# Altium project Pleiades_P01.PrjPcb (part 9 of 10)

## Sheet PCI.SchDoc
size 558 x 431 mm; SheetNumber: 18; SheetTotal: 25; Sheet_Name: PCI; Size: 11x17
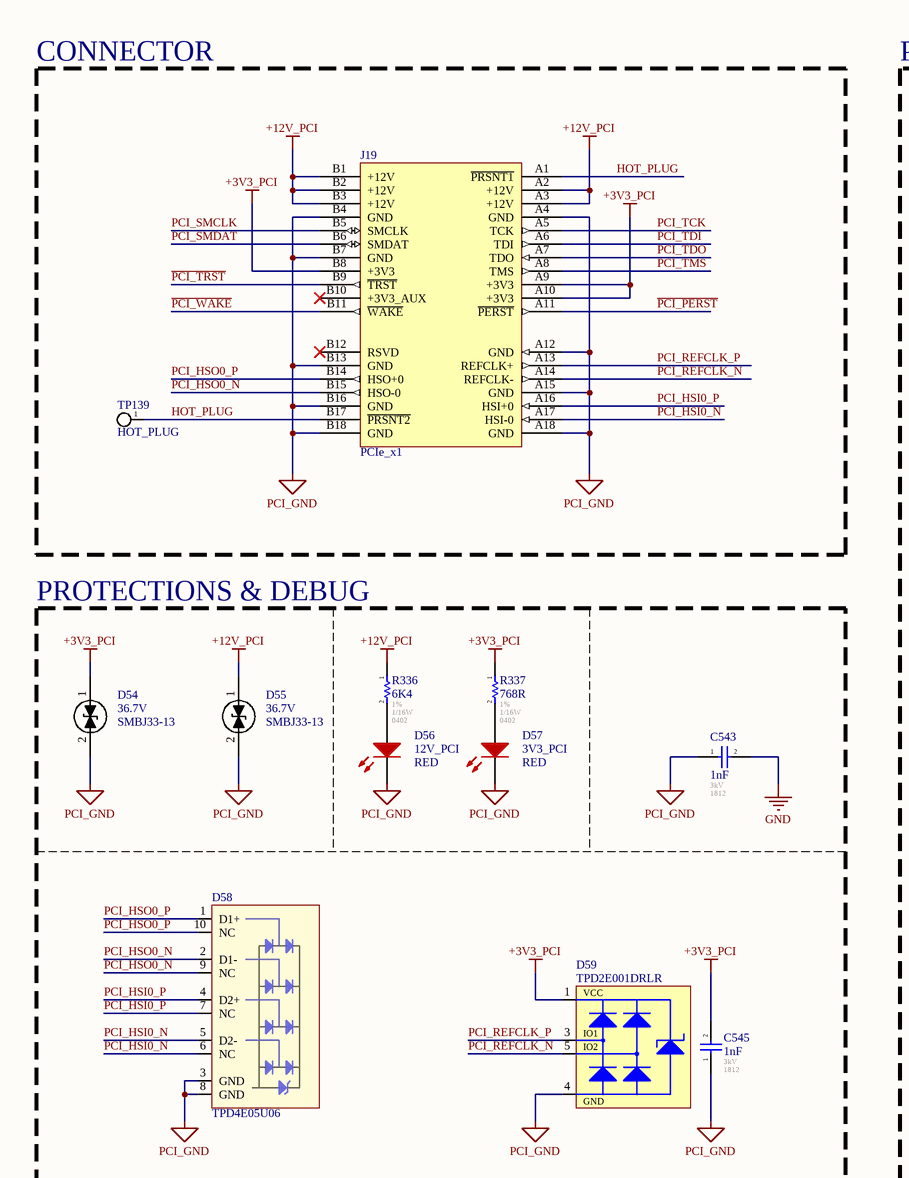
[diagram p59: PCI.SchDoc, top left]
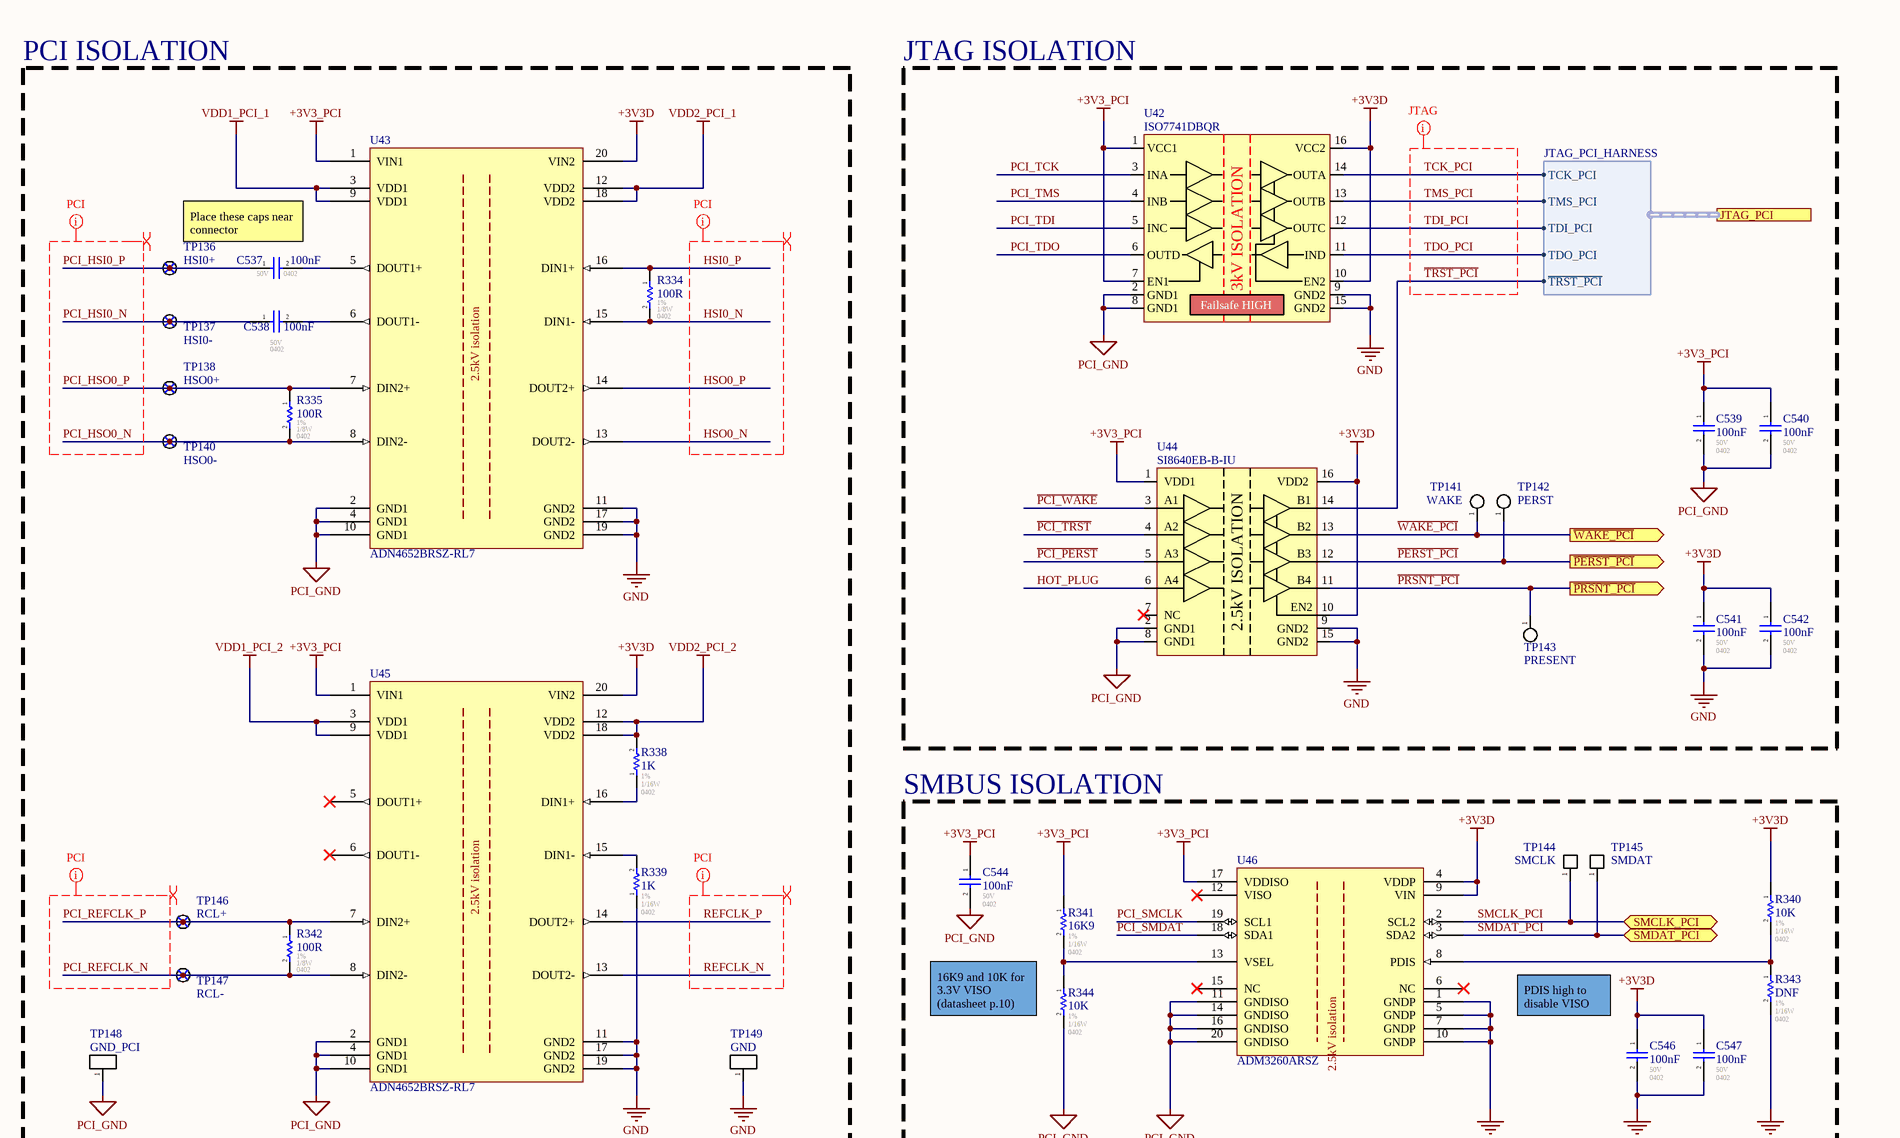
[diagram p60: PCI.SchDoc, top right]
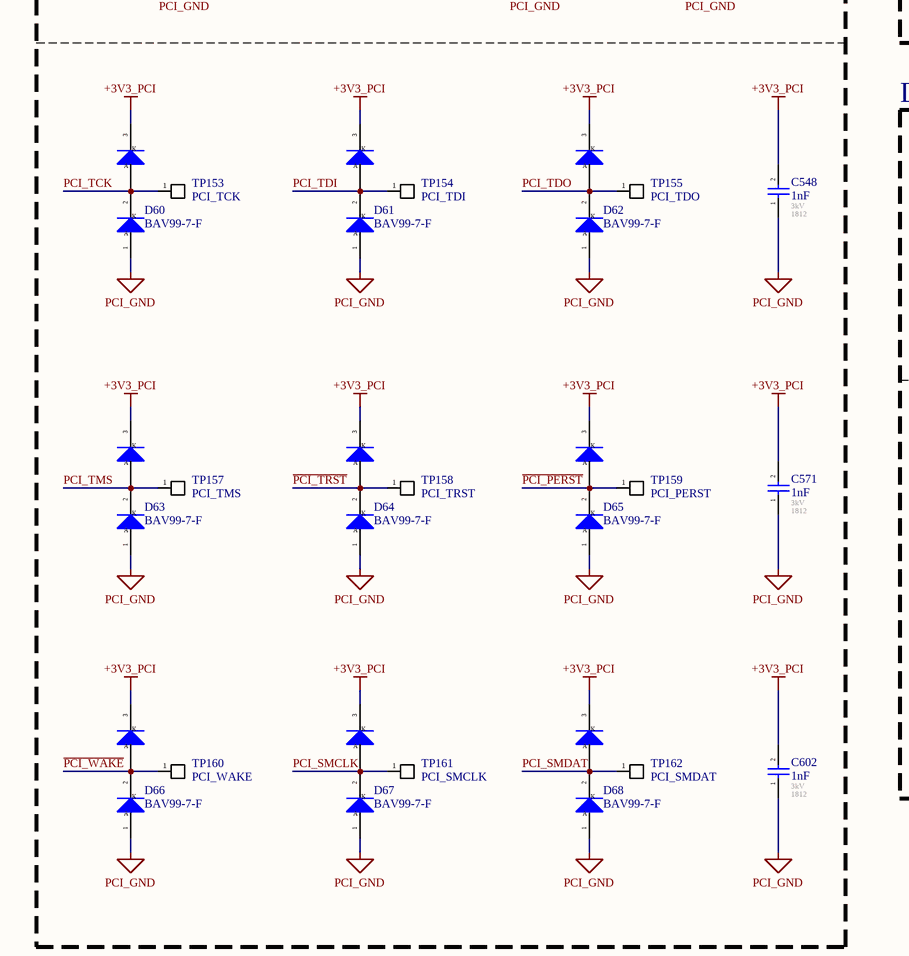
[diagram p61: PCI.SchDoc, bottom left]
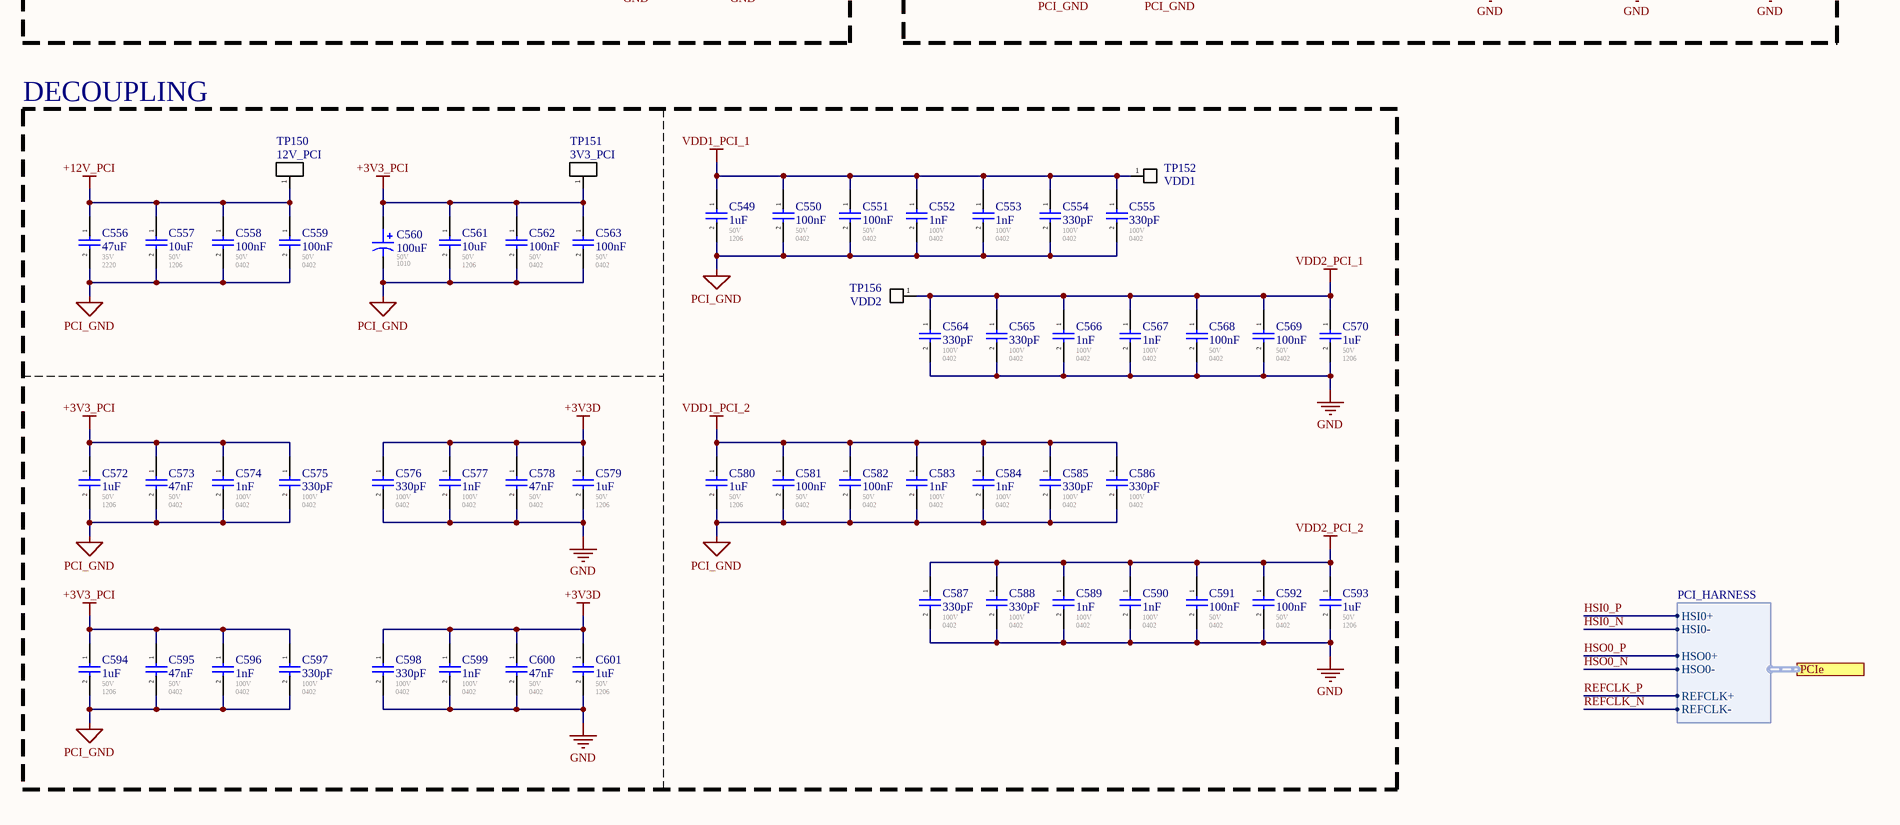
[diagram p62: PCI.SchDoc, bottom right]

### Parts
C537  100nF  Voltage - Rated: 50V  Footprint: 0402  [CAP_0402]
C538  100nF  Voltage - Rated: 50V  Footprint: 0402  [CAP_0402]
C539  100nF  Voltage - Rated: 50V  Footprint: 0402  [CAP_0402]
C540  100nF  Voltage - Rated: 50V  Footprint: 0402  [CAP_0402]
C541  100nF  Voltage - Rated: 50V  Footprint: 0402  [CAP_0402]
C542  100nF  Voltage - Rated: 50V  Footprint: 0402  [CAP_0402]
C543  1nF  Voltage - Rated: 3kV  Footprint: 1812  [CAP_1812]
C544  100nF  Voltage - Rated: 50V  Footprint: 0402  [CAP_0402]
C545  1nF  Voltage - Rated: 3kV  Footprint: 1812  [CAP_1812]
C546  100nF  Voltage - Rated: 50V  Footprint: 0402  [CAP_0402]
C547  100nF  Voltage - Rated: 50V  Footprint: 0402  [CAP_0402]
C548  1nF  Voltage - Rated: 3kV  Footprint: 1812  [CAP_1812]
C549  1uF  Voltage - Rated: 50V  Footprint: 1206  [CAP_1206]
C550  100nF  Voltage - Rated: 50V  Footprint: 0402  [CAP_0402]
C551  100nF  Voltage - Rated: 50V  Footprint: 0402  [CAP_0402]
C552  1nF  Voltage - Rated: 100V  Footprint: 0402  [CAP_0402]
C553  1nF  Voltage - Rated: 100V  Footprint: 0402  [CAP_0402]
C554  330pF  Voltage - Rated: 100V  Footprint: 0402  [CAP_0402]
C555  330pF  Voltage - Rated: 100V  Footprint: 0402  [CAP_0402]
C556  47uF  Voltage - Rated: 35V  Footprint: 2220  [CAP_2220]
C557  10uF  Voltage - Rated: 50V  Footprint: 1206  [CAP_1206]
C558  100nF  Voltage - Rated: 50V  Footprint: 0402  [CAP_0402]
C559  100nF  Voltage - Rated: 50V  Footprint: 0402  [CAP_0402]
C560  value 100uF  Voltage: 50V  Package: 1010  [CAP_ALU_1010_vishay]  (hidden comment: MAL215099101E3)
C561  10uF  Voltage - Rated: 50V  Footprint: 1206  [CAP_1206]
C562  100nF  Voltage - Rated: 50V  Footprint: 0402  [CAP_0402]
C563  100nF  Voltage - Rated: 50V  Footprint: 0402  [CAP_0402]
C564  330pF  Voltage - Rated: 100V  Footprint: 0402  [CAP_0402]
C565  330pF  Voltage - Rated: 100V  Footprint: 0402  [CAP_0402]
C566  1nF  Voltage - Rated: 100V  Footprint: 0402  [CAP_0402]
C567  1nF  Voltage - Rated: 100V  Footprint: 0402  [CAP_0402]
C568  100nF  Voltage - Rated: 50V  Footprint: 0402  [CAP_0402]
C569  100nF  Voltage - Rated: 50V  Footprint: 0402  [CAP_0402]
C570  1uF  Voltage - Rated: 50V  Footprint: 1206  [CAP_1206]
C571  1nF  Voltage - Rated: 3kV  Footprint: 1812  [CAP_1812]
C572  1uF  Voltage - Rated: 50V  Footprint: 1206  [CAP_1206]
C573  47nF  Voltage - Rated: 50V  Footprint: 0402  [CAP_0402]
C574  1nF  Voltage - Rated: 100V  Footprint: 0402  [CAP_0402]
C575  330pF  Voltage - Rated: 100V  Footprint: 0402  [CAP_0402]
C576  330pF  Voltage - Rated: 100V  Footprint: 0402  [CAP_0402]
C577  1nF  Voltage - Rated: 100V  Footprint: 0402  [CAP_0402]
C578  47nF  Voltage - Rated: 50V  Footprint: 0402  [CAP_0402]
C579  1uF  Voltage - Rated: 50V  Footprint: 1206  [CAP_1206]
C580  1uF  Voltage - Rated: 50V  Footprint: 1206  [CAP_1206]
C581  100nF  Voltage - Rated: 50V  Footprint: 0402  [CAP_0402]
C582  100nF  Voltage - Rated: 50V  Footprint: 0402  [CAP_0402]
C583  1nF  Voltage - Rated: 100V  Footprint: 0402  [CAP_0402]
C584  1nF  Voltage - Rated: 100V  Footprint: 0402  [CAP_0402]
C585  330pF  Voltage - Rated: 100V  Footprint: 0402  [CAP_0402]
C586  330pF  Voltage - Rated: 100V  Footprint: 0402  [CAP_0402]
C587  330pF  Voltage - Rated: 100V  Footprint: 0402  [CAP_0402]
C588  330pF  Voltage - Rated: 100V  Footprint: 0402  [CAP_0402]
C589  1nF  Voltage - Rated: 100V  Footprint: 0402  [CAP_0402]
C590  1nF  Voltage - Rated: 100V  Footprint: 0402  [CAP_0402]
C591  100nF  Voltage - Rated: 50V  Footprint: 0402  [CAP_0402]
C592  100nF  Voltage - Rated: 50V  Footprint: 0402  [CAP_0402]
C593  1uF  Voltage - Rated: 50V  Footprint: 1206  [CAP_1206]
C594  1uF  Voltage - Rated: 50V  Footprint: 1206  [CAP_1206]
C595  47nF  Voltage - Rated: 50V  Footprint: 0402  [CAP_0402]
C596  1nF  Voltage - Rated: 100V  Footprint: 0402  [CAP_0402]
C597  330pF  Voltage - Rated: 100V  Footprint: 0402  [CAP_0402]
C598  330pF  Voltage - Rated: 100V  Footprint: 0402  [CAP_0402]
C599  1nF  Voltage - Rated: 100V  Footprint: 0402  [CAP_0402]
C600  47nF  Voltage - Rated: 50V  Footprint: 0402  [CAP_0402]
C601  1uF  Voltage - Rated: 50V  Footprint: 1206  [CAP_1206]
C602  1nF  Voltage - Rated: 3kV  Footprint: 1812  [CAP_1812]
D54  SMBJ33-13  Voltage - Breakdown: 36.7V  [DO214AA (SMB)]
D55  SMBJ33-13  Voltage - Breakdown: 36.7V  [DO214AA (SMB)]
D56  12V_PCI  value RED  [LED_0603]
D57  3V3_PCI  value RED  [LED_0603]
D58  TPD4E05U06  [TVS_DATA_TPD4E05U06]
D59  TPD2E001DRLR  [TVS_USB_TPD2E001DRLR]
D60  BAV99-7-F  [SOT23-3]
D61  BAV99-7-F  [SOT23-3]
D62  BAV99-7-F  [SOT23-3]
D63  BAV99-7-F  [SOT23-3]
D64  BAV99-7-F  [SOT23-3]
D65  BAV99-7-F  [SOT23-3]
D66  BAV99-7-F  [SOT23-3]
D67  BAV99-7-F  [SOT23-3]
D68  BAV99-7-F  [SOT23-3]
J19  PCIe_x1  [PCIe_x1]  (no BOM)
R334  100R  Tolerance: 1%  Power: 1/8W  Package / Case: 0402  [RES_0402]
R335  100R  Tolerance: 1%  Power: 1/8W  Package / Case: 0402  [RES_0402]
R336  6K4  Tolerance: 1%  Power: 1/16W  Package / Case: 0402  [RES_0402]
R337  768R  Tolerance: 1%  Power: 1/16W  Package / Case: 0402  [RES_0402]
R338  1K  Tolerance: 1%  Power: 1/16W  Package / Case: 0402  [RES_0402]
R339  1K  Tolerance: 1%  Power: 1/16W  Package / Case: 0402  [RES_0402]
R340  10K  Tolerance: 1%  Power: 1/16W  Package / Case: 0402  [RES_0402]
R341  16K9  Tolerance: 1%  Power: 1/16W  Package / Case: 0402  [RES_0402]
R342  100R  Tolerance: 1%  Power: 1/8W  Package / Case: 0402  [RES_0402]
R343  DNF  Tolerance: 1%  Power: 1/16W  Package / Case: 0402  [RES_0402]
R344  10K  Tolerance: 1%  Power: 1/16W  Package / Case: 0402  [RES_0402]
TP136  HSI0+  [TP_PAD_TINY]  (no BOM)
TP137  HSI0-  [TP_PAD_TINY]  (no BOM)
TP138  HSO0+  [TP_PAD_TINY]  (no BOM)
TP139  HOT_PLUG  [TP_PAD_SMALL]  (no BOM)
TP140  HSO0-  [TP_PAD_TINY]  (no BOM)
TP141  WAKE  [TP_PAD_SMALL]  (no BOM)
TP142  PERST  [TP_PAD_SMALL]  (no BOM)
TP143  PRESENT  [TP_PAD_SMALL]  (no BOM)
TP144  SMCLK  [TP_PAD]  (no BOM)
TP145  SMDAT  [TP_PAD]  (no BOM)
TP146  RCL+  [TP_PAD_TINY]  (no BOM)
TP147  RCL-  [TP_PAD_TINY]  (no BOM)
TP148  GND_PCI  [TP_HOLE]  (no BOM)
TP149  GND  [TP_HOLE]  (no BOM)
TP150  12V_PCI  [TP_HOLE]  (no BOM)
TP151  3V3_PCI  [TP_HOLE]  (no BOM)
TP152  VDD1  [TP_PAD]  (no BOM)
TP153  PCI_TCK  [TP_PAD]  (no BOM)
TP154  PCI_TDI  [TP_PAD]  (no BOM)
TP155  PCI_TDO  [TP_PAD]  (no BOM)
TP156  VDD2  [TP_PAD]  (no BOM)
TP157  PCI_TMS  [TP_PAD]  (no BOM)
TP158  PCI_TRST  [TP_PAD]  (no BOM)
TP159  PCI_PERST  [TP_PAD]  (no BOM)
TP160  PCI_WAKE  [TP_PAD]  (no BOM)
TP161  PCI_SMCLK  [TP_PAD]  (no BOM)
TP162  PCI_SMDAT  [TP_PAD]  (no BOM)
U42  ISO7741DBQR  [ISO_ISO7741DBQR]
U43  ADN4652BRSZ-RL7  [TSSOP-20_5.3MM]
U44  SI8640EB-B-IU  [ISO_SI8640EB-B-IU]
U45  ADN4652BRSZ-RL7  [TSSOP-20_5.3MM]
U46  ADM3260ARSZ  [TSSOP-20_5.3MM]

### Blocks framed on the sheet
CONNECTOR: J19 TP139
PCI ISOLATION: C537 C538 R334 R335 R338 R339 R342 TP136-TP138 TP140 TP146-TP149 U43 U45
JTAG ISOLATION: C539-C542 TP141-TP143 U42 U44
PROTECTIONS & DEBUG: C543 C545 C548 C571 C602 D54-D68 R336 R337 TP153-TP155 TP157-TP162
SMBUS ISOLATION: C544 C546 C547 R340 R341 R343 R344 TP144 TP145 U46
DECOUPLING: C549-C570 C572-C601 TP150-TP152 TP156

### Ports
JTAG_PCI (harness JTAG_PCI_HARNESS), PCIe (harness PCI_HARNESS), SMCLK_PCI (bidir), SMDAT_PCI (bidir), ~{PERST_PCI} (out), ~{PRSNT_PCI} (out), ~{WAKE_PCI} (out)

### Harnesses
JTAG_PCI_HARNESS: TCK_PCI, TDO_PCI, TDI_PCI, TMS_PCI, ~{TRST_PCI}
PCI_HARNESS: HSI0+, HSI0-, HSO0+, HSO0-, REFCLK+, REFCLK-

### Nets
+3V3_PCI: C539.1 C540.1 C544.1 C545.2 C548.2 C560.1 C561.1 C562.1 C563.1 C571.2 C572.1 C573.1 C574.1 C575.1 C594.1 C595.1 C596.1 C597.1 C602.2 D54.1(A) D59.1(VCC) D60.3(K) D61.3(K) D62.3(K) D63.3(K) D64.3(K) D65.3(K) D66.3(K) D67.3(K) D68.3(K) J19.A9(+3V3) J19.A10(+3V3) J19.B8(+3V3) R337.1 R341.1 TP151.1(A) U42.1(VCC1) U42.7(EN1) U43.1(VIN1) U44.1(VDD1) U45.1(VIN1) U46.17(VDDISO)
+3V3D: C541.1 C542.1 C546.1 C547.1 C576.1 C577.1 C578.1 C579.1 C598.1 C599.1 C600.1 C601.1 R340.1 U42.10(EN2) U42.16(VCC2) U43.20(VIN2) U44.10(EN2) U44.16(VDD2) U45.20(VIN2) U46.4(VDDP) U46.9(VIN)
+12V_PCI: C556.1 C557.1 C558.1 C559.1 D55.1(A) J19.A2(+12V) J19.A3(+12V) J19.B1(+12V) J19.B2(+12V) J19.B3(+12V) R336.1 TP150.1(A)
GND: C541.2 C542.2 C543.2 C546.2 C547.2 C564.2 C565.2 C566.2 C567.2 C568.2 C569.2 C570.2 C576.2 C577.2 C578.2 C579.2 C587.2 C588.2 C589.2 C590.2 C591.2 C592.2 C593.2 C598.2 C599.2 C600.2 C601.2 R339.1 R343.2 TP149.1(A) U42.9(GND2) U42.15(GND2) U43.11(GND2) U43.17(GND2) U43.19(GND2) U44.9(GND2) U44.15(GND2) U45.11(GND2) U45.17(GND2) U45.19(GND2) U46.1(GNDP) U46.5(GNDP) U46.7(GNDP) U46.10(GNDP)
PCI_GND: C539.2 C540.2 C543.1 C544.2 C545.1 C548.1 C549.2 C550.2 C551.2 C552.2 C553.2 C554.2 C555.2 C556.2 C557.2 C558.2 C559.2 C560.2 C561.2 C562.2 C563.2 C571.1 C572.2 C573.2 C574.2 C575.2 C580.2 C581.2 C582.2 C583.2 C584.2 C585.2 C586.2 C594.2 C595.2 C596.2 C597.2 C602.1 D54.2(C) D55.2(C) D56.2(K) D57.2(K) D58.3(GND) D58.8(GND) D59.4(GND) D60.1(A) D61.1(A) D62.1(A) D63.1(A) D64.1(A) D65.1(A) D66.1(A) D67.1(A) D68.1(A) J19.A4(GND) J19.A12(GND) J19.A15(GND) J19.A18(GND) J19.B4(GND) J19.B7(GND) J19.B13(GND) J19.B16(GND) J19.B18(GND) R344.2 TP148.1(A) U42.2(GND1) U42.8(GND1) U43.2(GND1) U43.4(GND1) U43.10(GND1) U44.2(GND1) U44.8(GND1) U45.2(GND1) U45.4(GND1) U45.10(GND1) U46.11(GNDISO) U46.14(GNDISO) U46.16(GNDISO) U46.20(GNDISO)
VDD1_PCI_1: C549.1 C550.1 C551.1 C552.1 C553.1 C554.1 C555.1 TP152.1(A) U43.3(VDD1) U43.9(VDD1)
VDD1_PCI_2: C580.1 C581.1 C582.1 C583.1 C584.1 C585.1 C586.1 U45.3(VDD1) U45.9(VDD1)
VDD2_PCI_1: C564.1 C565.1 C566.1 C567.1 C568.1 C569.1 C570.1 TP156.1(A) U43.12(VDD2) U43.18(VDD2)
VDD2_PCI_2: C587.1 C588.1 C589.1 C590.1 C591.1 C592.1 C593.1 R338.2 U45.12(VDD2) U45.18(VDD2)
~{PCI_PERST}: D65.2(K) J19.A11(~{PERST}) TP159.1(A) U44.5(A3)  [project net ~{PCI_PERST_18}]
~{PCI_TRST}: D64.2(K) J19.B9(~{TRST}) TP158.1(A) U44.4(A2)  [project net ~{PCI_TRST_18}]
~{PCI_WAKE}: D66.2(K) J19.B11(~{WAKE}) TP160.1(A) U44.3(A1)  [project net ~{PCI_WAKE_18}]
~{PERST_PCI}: TP142.1(A) U44.12(B3) ; port ~{PERST_PCI}
~{PRSNT_PCI}: TP143.1(A) U44.11(B4) ; port ~{PRSNT_PCI}
~{TRST_PCI}: U44.14(B1) ; port JTAG_PCI.~{TRST_PCI}  [project net ~{PCI_TRST}]
~{WAKE_PCI}: TP141.1(A) U44.13(B2) ; port ~{WAKE_PCI}
HOT_PLUG: J19.A1(~{PRSNT1}) J19.B17(~{PRSNT2}) TP139.1(A) U44.6(A4)  [project net HOT_PLUG_18]
HSI0_N: R334.2 U43.15(DIN1-) ; port PCIe.HSI0-
HSI0_P: R334.1 U43.16(DIN1+) ; port PCIe.HSI0+
HSO0_N: U43.13(DOUT2-) ; port PCIe.HSO0-
HSO0_P: U43.14(DOUT2+) ; port PCIe.HSO0+
PCI_HSI0_N: C538.1 D58.5(D2-) D58.6(NC) J19.A17(HSI-0) TP137.1(A)  [project net PCI_HSI0_N_18]
PCI_HSI0_P: C537.1 D58.4(D2+) D58.7(NC) J19.A16(HSI+0) TP136.1(A)  [project net PCI_HSI0_P_18]
PCI_HSO0_N: D58.2(D1-) D58.9(NC) J19.B15(HSO-0) R335.2 TP140.1(A) U43.8(DIN2-)  [project net PCI_HSO0_N_18]
PCI_HSO0_P: D58.1(D1+) D58.10(NC) J19.B14(HSO+0) R335.1 TP138.1(A) U43.7(DIN2+)  [project net PCI_HSO0_P_18]
PCI_REFCLK_N: D59.5(IO2) J19.A14(REFCLK-) R342.2 TP147.1(A) U45.8(DIN2-)  [project net PCI_REFCLK_N_18]
PCI_REFCLK_P: D59.3(IO1) J19.A13(REFCLK+) R342.1 TP146.1(A) U45.7(DIN2+)  [project net PCI_REFCLK_P_18]
PCI_SMCLK: D67.2(K) J19.B5(SMCLK) TP161.1(A) U46.19(SCL1)  [project net PCI_SMCLK_18]
PCI_SMDAT: D68.2(K) J19.B6(SMDAT) TP162.1(A) U46.18(SDA1)  [project net PCI_SMDAT_18]
PCI_TCK: D60.2(K) J19.A5(TCK) TP153.1(A) U42.3(INA)  [project net PCI_TCK_18]
PCI_TDI: D61.2(K) J19.A6(TDI) TP154.1(A) U42.5(INC)  [project net PCI_TDI_18]
PCI_TDO: D62.2(K) J19.A7(TDO) TP155.1(A) U42.6(OUTD)  [project net PCI_TDO_18]
PCI_TMS: D63.2(K) J19.A8(TMS) TP157.1(A) U42.4(INB)  [project net PCI_TMS_18]
REFCLK_N: U45.13(DOUT2-) ; port PCIe.REFCLK-
REFCLK_P: U45.14(DOUT2+) ; port PCIe.REFCLK+
SMCLK_PCI: TP144.1(A) U46.2(SCL2) ; port SMCLK_PCI
SMDAT_PCI: TP145.1(A) U46.3(SDA2) ; port SMDAT_PCI
TCK_PCI: U42.14(OUTA) ; port JTAG_PCI.TCK_PCI  [project net PCI_TCK]
TDI_PCI: U42.12(OUTC) ; port JTAG_PCI.TDI_PCI  [project net PCI_TDI]
TDO_PCI: U42.11(IND) ; port JTAG_PCI.TDO_PCI  [project net PCI_TDO]
TMS_PCI: U42.13(OUTB) ; port JTAG_PCI.TMS_PCI  [project net PCI_TMS]
NetC537_2: C537.2 U43.5(DOUT1+)
NetC538_2: C538.2 U43.6(DOUT1-)
NetD56_1: D56.1(A) R336.2
NetD57_1: D57.1(A) R337.2
NetR338_1: R338.1 U45.16(DIN1+)
NetR339_2: R339.2 U45.15(DIN1-)
NetR340_2: R340.2 R343.1 U46.8(PDIS)
NetR341_2: R341.2 R344.1 U46.13(VSEL)

Not connected (* = marked no-connect by the designer): D59 2(NC); J19 B10(+3V3_AUX)* B12(RSVD)*; U44 7(NC)*; U45 5(DOUT1+)* 6(DOUT1-)*; U46 6(NC)* 12(VISO)* 15(NC)*

### Layout directives
net class JTAG: TCK_PCI, TDI_PCI, TDO_PCI, TMS_PCI, ~{TRST_PCI}
net class PCI: HSI0_N, HSI0_P, HSO0_N, HSO0_P, PCI_HSI0_N, PCI_HSI0_P, PCI_HSO0_N, PCI_HSO0_P, PCI_REFCLK_N, PCI_REFCLK_P, REFCLK_N, REFCLK_P
differential pair: HSI0_N, HSI0_P, HSO0_N, HSO0_P, PCI_HSI0_N, PCI_HSI0_P, PCI_HSO0_N, PCI_HSO0_P, PCI_REFCLK_N, PCI_REFCLK_P, REFCLK_N, REFCLK_P

### Notes on the sheet
- Place these caps near connector
- 16K9 and 10K for 3.3V VISO
  (datasheet p.10)
- (near C546) PDIS high to disable VISO
- Sheet Name
- Project Title
- Global Project
- Revision
- Size
- Date
- Group
- Sheet
- of
- Filename
- Designers
- (in symbol ADM3260ARSZ) 2.5kV isolation
- (in symbol ADN4652BRSZ-RL7) 2.5kV isolation
- (in symbol ISO_ISO7741DBQR) 3kV ISOLATION; Failsafe HIGH
- (in symbol ISO_SI8640EB-B-IU) 2.5kV ISOLATION

### Library data of the parts
C537-C542 C544 C546 C547 C550 C551 C558 C559 C562 C563 C568 C569 C581 C582 C591 C592 = CAP_CER: GCM155R71H104KE02J / 0402 100nF 10% X7R Ceramic Capacitor; Mfr: Murata; Operating Temperature: -55C - 125C; Temperature Coefficient: X7R; ComponentLink1Description: Digikey; ComponentLink1URL: [Digikey Link]; Part#: GCM155R71H104KE02J; ComponentLink2Description: Datasheet; ComponentLink2URL: [Datasheet Link]; Tolerance: 10%; Ratings: AEC-Q200
C543 C545 C548 C571 C602 = CAP_CER: C1812C102KHRACAUTO / 0402 470pF 10% X7R Ceramic Capacitor; Mfr: KEMET; Operating Temperature: -55C - 125C; Temperature Coefficient: X7R; ComponentLink1Description: Digikey; ComponentLink1URL: https://www.digikey.com/en/products/detail/kemet/C1812C102KHRACAUTO/8109956; Part#: C1812C102KHRACAUTO; ComponentLink2Description: Datasheet; ComponentLink2URL: https://connect.kemet.com:7667/gateway/IntelliData-ComponentDocumentation/1.0/download/datasheet/C1812C102KHRACAUTO; Tolerance: 10%; Ratings: AEC-Q200; ComponentLink3Description: KEMET; ComponentLink3URL: https://www.kemet.com/en/us/capacitors/ceramic/product/C1812C102KHRACAUTO.html; ComponentLink4Description: Octopart; ComponentLink4URL: https://octopart.com/c1812c102khracauto-kemet-67309371?r=sp; Features: Low ESL, High Voltage; Supplier 1: Mouser; Supplier Part Number 1: 80-C1812C102KHRAUTO
C549 C570 C572 C579 C580 C593 C594 C601 = CAP_CER: GCJ31CR71H105KA12L / 1206 1uF 10% X7R Ceramic Capacitor; Mfr: Murata; Operating Temperature: -55C - 125C; Temperature Coefficient: X7R; ComponentLink1Description: Digikey; ComponentLink1URL: [Digikey Link]; Part#: GCJ31CR71H105KA12L; ComponentLink2Description: Datasheet; ComponentLink2URL: [Datasheet Link]; Tolerance: 10%; Ratings: AEC-Q200
C552 C553 C566 C567 C574 C577 C583 C584 C589 C590 C596 C599 = CAP_CER: GCM155R72A102KA37D / 0402 1nF 10% X7R Ceramic Capacitor; Mfr: Murata; Operating Temperature: -55C - 125C; Temperature Coefficient: X7R; ComponentLink1Description: Digikey; ComponentLink1URL: [Digikey Link]; Part#: GCM155R72A102KA37D; ComponentLink2Description: Datasheet; ComponentLink2URL: [Datasheet Link]; Tolerance: 10%; Ratings: AEC-Q200
C554 C555 C564 C565 C575 C576 C585-C588 C597 C598 = CAP_CER: GCM155R72A331KA37D / 0402 330pF 10% X7R Ceramic Capacitor; Mfr: Murata; Operating Temperature: -55C - 125C; Temperature Coefficient: X7R; ComponentLink1Description: Digikey; ComponentLink1URL: https://www.digikey.ca/en/products/detail/murata-electronics/GCM155R72A331KA37D/2591348; Part#: GCM155R72A331KA37D; ComponentLink2Description: Datasheet; ComponentLink2URL: https://search.murata.co.jp/Ceramy/image/img/A01X/G101/ENG/GCM155R72A331KA37-01A.pdf; Tolerance: 10%; Ratings: AEC-Q200; ComponentLink3Description: Murata; ComponentLink3URL: https://www.murata.com/en-us/products/productdetail?partno=GCM155R72A331KA37%23; ComponentLink4Description: Octopart; ComponentLink4URL: https://octopart.com/gcm155r72a331ka37d-murata-18331888?r=sp; Supplier 1: Arrow Electronics; Supplier Part Number 1: GCM155R72A331KA37D
C556 = CAP_CER: CGA9N1X7R1V476M230KC / 2220 47uF 20% X7R Ceramic Capacitor; Mfr: TDK; Operating Temperature: -55C - 125C; Temperature Coefficient: X7R; ComponentLink1Description: Digikey; ComponentLink1URL: https://www.digikey.ca/en/products/detail/tdk-corporation/CGA9N1X7R1V476M230KC/15930202; ComponentLink2Description: Datasheet; ComponentLink2URL: https://product.tdk.com/system/files/dam/doc/product/capacitor/ceramic/mlcc/catalog/mlcc_automotive_general_en.pdf; Tolerance: 20%; Ratings: AEC-Q200; Part#: CGA9N1X7R1V476M230KC; ComponentLink3Description: TDK; ComponentLink3URL: https://product.tdk.com/en/search/capacitor/ceramic/mlcc/info?part_no=CGA9N1X7R1V476M230KC; ComponentLink4Description: Octopart; ComponentLink4URL: https://octopart.com/cga9n1x7r1v476m230kc-tdk-122377816?r=sp; Supplier 1: Newark; Supplier Part Number 1: 57AK9414
C557 C561 = CAP_CER: GRT31CR61H106KE01L / 1206 10uF 10% X5R Ceramic Capacitor; Mfr: Murata; Operating Temperature: -55C - 85C; Temperature Coefficient: X5R; ComponentLink1Description: Digikey; ComponentLink1URL: [Digikey Link]; ComponentLink2Description: Datasheet; ComponentLink2URL: [Datasheet Link]; Tolerance: 10%; Ratings: AEC-Q200; Supplier 1: Arrow Electronics; Supplier Part Number 1: GRT31CR61H106KE01L; Part#: GRT31CR61H106KE01L
C560 = CAP_ALU_MAL215099101E3: CAP - ALU 100uF 20% 50V - 1010; Current: 490mA; Mfg: Vishay Dale; Mfg Part Number: MAL215099101E3; HelpURL: http://www.vishay.com/docs/28395/150crz.pdf; CreatedBy: Jonathan Bouchard; Temperature: -55°C to 125°C; Power: *; Supplier 1: Digikey; Supplier Part Number 1: 4399PHDKR-ND; Precision: 20%
C573 C578 C595 C600 = CAP_CER: GCM155R71H473KE02J / 0402 47nF 10% X7R Ceramic Capacitor; Mfr: Murata; Operating Temperature: -55C - 125C; Temperature Coefficient: X7R; ComponentLink1Description: Digikey; ComponentLink1URL: [Digikey Link]; Part#: GCM155R71H473KE02J; ComponentLink2Description: Datasheet; ComponentLink2URL: [Datasheet Link]; Tolerance: 10%; Ratings: AEC-Q200
D54 D55 = DIODE_TVS: 53.3V Clamp 11.3A Ipp Tvs Diode Surface Mount SMB; Mfr: SMBJ33CAQ-13-F; Voltage - Reverse: 33V; Operating Temperature: *; Package / Case: SMB; Current: 11.3A; ComponentLink1Description: Digikey; ComponentLink1URL: https://www.digikey.ca/en/products/detail/diodes-incorporated/SMBJ33CAQ-13-F/9738859
D56 D57 = LED_SML-311UTT86: LED - 620nM RED 2mA - 0603; Voltage: 1.8V; Mfg: ROHM Semiconductor; Power: 44mW; Current: 2mA; HelpURL: http://media.digikey.com/pdf/Data%20Sheets/Rohm%20PDFs/SML-311%20Series.pdf; CreatedBy: Jonathan Bouchard; Temperature: -30°C to 85°C; Package: 0603; Precision: *; Mfg Part Number: SML-311UTT86; Supplier 1: Digikey; Supplier Part Number 1: 511-1304-1-ND
D58 = TVS_DATA_TPD4E05U06: TVS - TVS DIODE 5.5VWM 14VC - 10SON; Manufacturer #1: Texas Instruments; Part Number #1: TPD4E05U06DQAR; Current Rating: 2.5A (8/20µs); Power Max: 40 W (peak); Value: 4 unidirectionnal channels; Voltage rating: 6V (Breakdown); Polarized: YES; Magnetic Material: UNKNOWN; GRAMS Lib Spec: 2.8; Manufacturer #2: *; Part Number #2: *; HelpURL: http://www.ti.com/lit/ds/symlink/tpd4e05u06.pdf; Supplier 1: Digi-Key; Supplier Part Number 1: 296-35765-1-ND; Note: *; Assembly Type: SMD; Temperature: -40°C ~ 125°C; Package: 10-USON; CreatedBy/Date: Olivier Bernard / 12/3/2018; Tolerance: *; VerifiedBy: Caroline Paulin / 4 juillet 2018; Cryo: UNKNOWN
D59 = TVS_USB_TPD2E001DRLR: TVS - USB TVS DIODE 5.5V - SOT-553; Manufacturer #1: Texas Instruments; Value: 11V Breakdown; Voltage Rating: 5.5V (Max); GRAMS Lib Spec: 2.8; Magnetic Material: YES; Cryo: UNKNOWN; Tolerance: *; Current Rating: *; Power Max: *; HelpURL: http://www.ti.com/lit/ds/symlink/tpd2e001.pdf; CreatedBy/Date: Jonathan Bouchard 2018-07-10; VerifiedBy: Arnaud Samson 16-07-18; Temperature: -40°C ~ 85°C (TA); Package: SOT-553; Manufacturer #2: *; Note: *; Assembly Type: SMD; Part Number #2: *; Part Number #1: TPD2E001DRLR; Polarized: YES; Supplier 1: Digi-Key; Supplier Part Number 1: 296-21883-1-ND
D60-D68 = DIODE_TVS_DUAL: Diode Array 1 Pair Series Connection 75 V 300mA (DC) Surface Mount TO-236-3, SC-59, SOT-23-3; Mfr: Diodes Incorporated; Voltage - DC Reverse: 75V; Voltage - Forward: 1.25V @ 150mA; Reverse Recovery Time: 4ns; Capacitance: 2pF; Current - Reverse Leakage: 2.5µA @ 75V; Operating Temperature: -65C - 150C; Package / Case: SOT-23-3; Current: 300mA; ComponentLink1Description: Digikey; ComponentLink1URL: https://www.digikey.ca/en/products/detail/diodes-incorporated/BAV99-7-F/815018; ComponentLink2Description: Datasheet; ComponentLink2URL: https://www.diodes.com/assets/Datasheets/BAV99.pdf; ComponentLink3Description: Octopart; ComponentLink3URL: https://octopart.com/bav99-7-f-diodes+inc.-326328; Supplier 1: Future Electronics; Supplier Part Number 1: 3851920
R334-R344 = RESISTOR: Automotive: AEC-Q200; Operating Temperature: *; # Digikey: *; ComponentLink1Description: Digikey; ComponentLink1URL: *; # Manufacturer: *
TP136-TP138 TP140 TP146 TP147 = TESTPOINT_PAD_TINY: Test Point
TP139 TP141-TP143 = TESTPOINT_PAD_SMALL: Test Point
TP144 TP145 TP152-TP162 = TESTPOINT_PAD: Test Point
TP148-TP151 = TESTPOINT: Test Point; ClassName: Testpoint
U42 = ISO_ISO7741DBQR: ISO - Quad-Channel Digital Isolator 3/1 (Default High)- 16-SSOP; Manufacturer #1: Texas Instruments; Voltage Rating: 2.25-5.5V; GRAMS Lib Spec: 2.8c; Magnetic Material: Unknown; Polarized: Yes; Value: *; Tolerance: *; Current Rating: *; Power Max: *; HelpURL: http://www.ti.com/lit/ds/symlink/iso7741.pdf; CreatedBy/Date: Louis-Daniel Gaulin / 11-03-2020; VerifiedBy: C.Paulin - 20/04/2020; Temperature: -55°C ~ 125°C; Package: 16-SSOP; Manufacturer #2: *; Assembly Type: SMD; Part Number #2: *; Part Number #1: ISO7741DBQR; Supplier 1: Digi-Key; Supplier Part Number 1: 296-47660-1-ND; Cryo: UNKNOWN
U43 U45 = ADN4652BRSZ-RL7: Mfr: Analog Devices; Protocol: LVDS; Inputs - Side1 / Side2: 1/1; Channel Type: Unidirectional; Voltage - Isolation: 3750Vrms; Data Rate: 600Mbps; Voltage - Supply: 2.375V - 2.625V; Type: Magnetic Coupling; Operating Temperature: -40C - 125C; ComponentLink1Description: Digikey; ComponentLink1URL: https://www.digikey.com/en/products/detail/analog-devices-inc/ADN4652BRSZ-RL7/6624085; ComponentLink2Description: Datasheet; ComponentLink2URL: https://www.analog.com/media/en/technical-documentation/data-sheets/ADN4650-4651-4652.pdf; ComponentLink3Description: Analog Devices; ComponentLink3URL: https://www.analog.com/en/products/adn4652.html?doc=ADN4650-4651-4652.pdf; ComponentLink4Description: Octopart; ComponentLink4URL: https://octopart.com/adn4652brsz-rl7-analog+devices-77756952?r=sp; Supplier 1: Mouser; Supplier Part Number 1: 584-ADN4652BRSZ-RL7
U44 = ISO_SI8640EB-B-IU: ISO - Quad-Channel Digital Isolator (default HI) - 16-SSOP; Manufacturer #1: Silicon Labs; Voltage Rating: 2.5-5.5V; GRAMS Lib Spec: 2.8; Magnetic Material: Unknown; Polarized: Yes; Value: *; Tolerance: *; Current Rating: *; Power Max: *; HelpURL: https://www.silabs.com/documents/public/data-sheets/si864x-datasheet.pdf; CreatedBy/Date: Joel Lemay 2018-06-05; VerifiedBy: Caroline Paulin - 12 sept 2018; Temperature: -40°C ~ 125°C; Package: 16-SSOP; Manufacturer #2: *; Assembly Type: SMD; Part Number #2: *; Part Number #1: SI8640EB-B-IU; Supplier 1: Digi-Key; Supplier Part Number 1: 336-4288-ND; Cryo: UNKNOWN
U46 = ADM3260ARSZ: I2C Digital Isolator 2500Vrms 2 Channel 25kV/µs CMTI 20-SSOP (0.209", 5.30mm Width); Mfr: Analog Devices; Channel Type: Bidirectionnal; Voltage - Isolation: 2.5kV; Voltage - Supply: 3V - 5.5V; Type: I2C; Operating Temperature: -40C - 105C

## Sheet SENSORS.SchDoc
size Tabloid; SheetNumber: 15; SheetTotal: 25; Sheet_Name: MECHANICAL; Size: 11x17
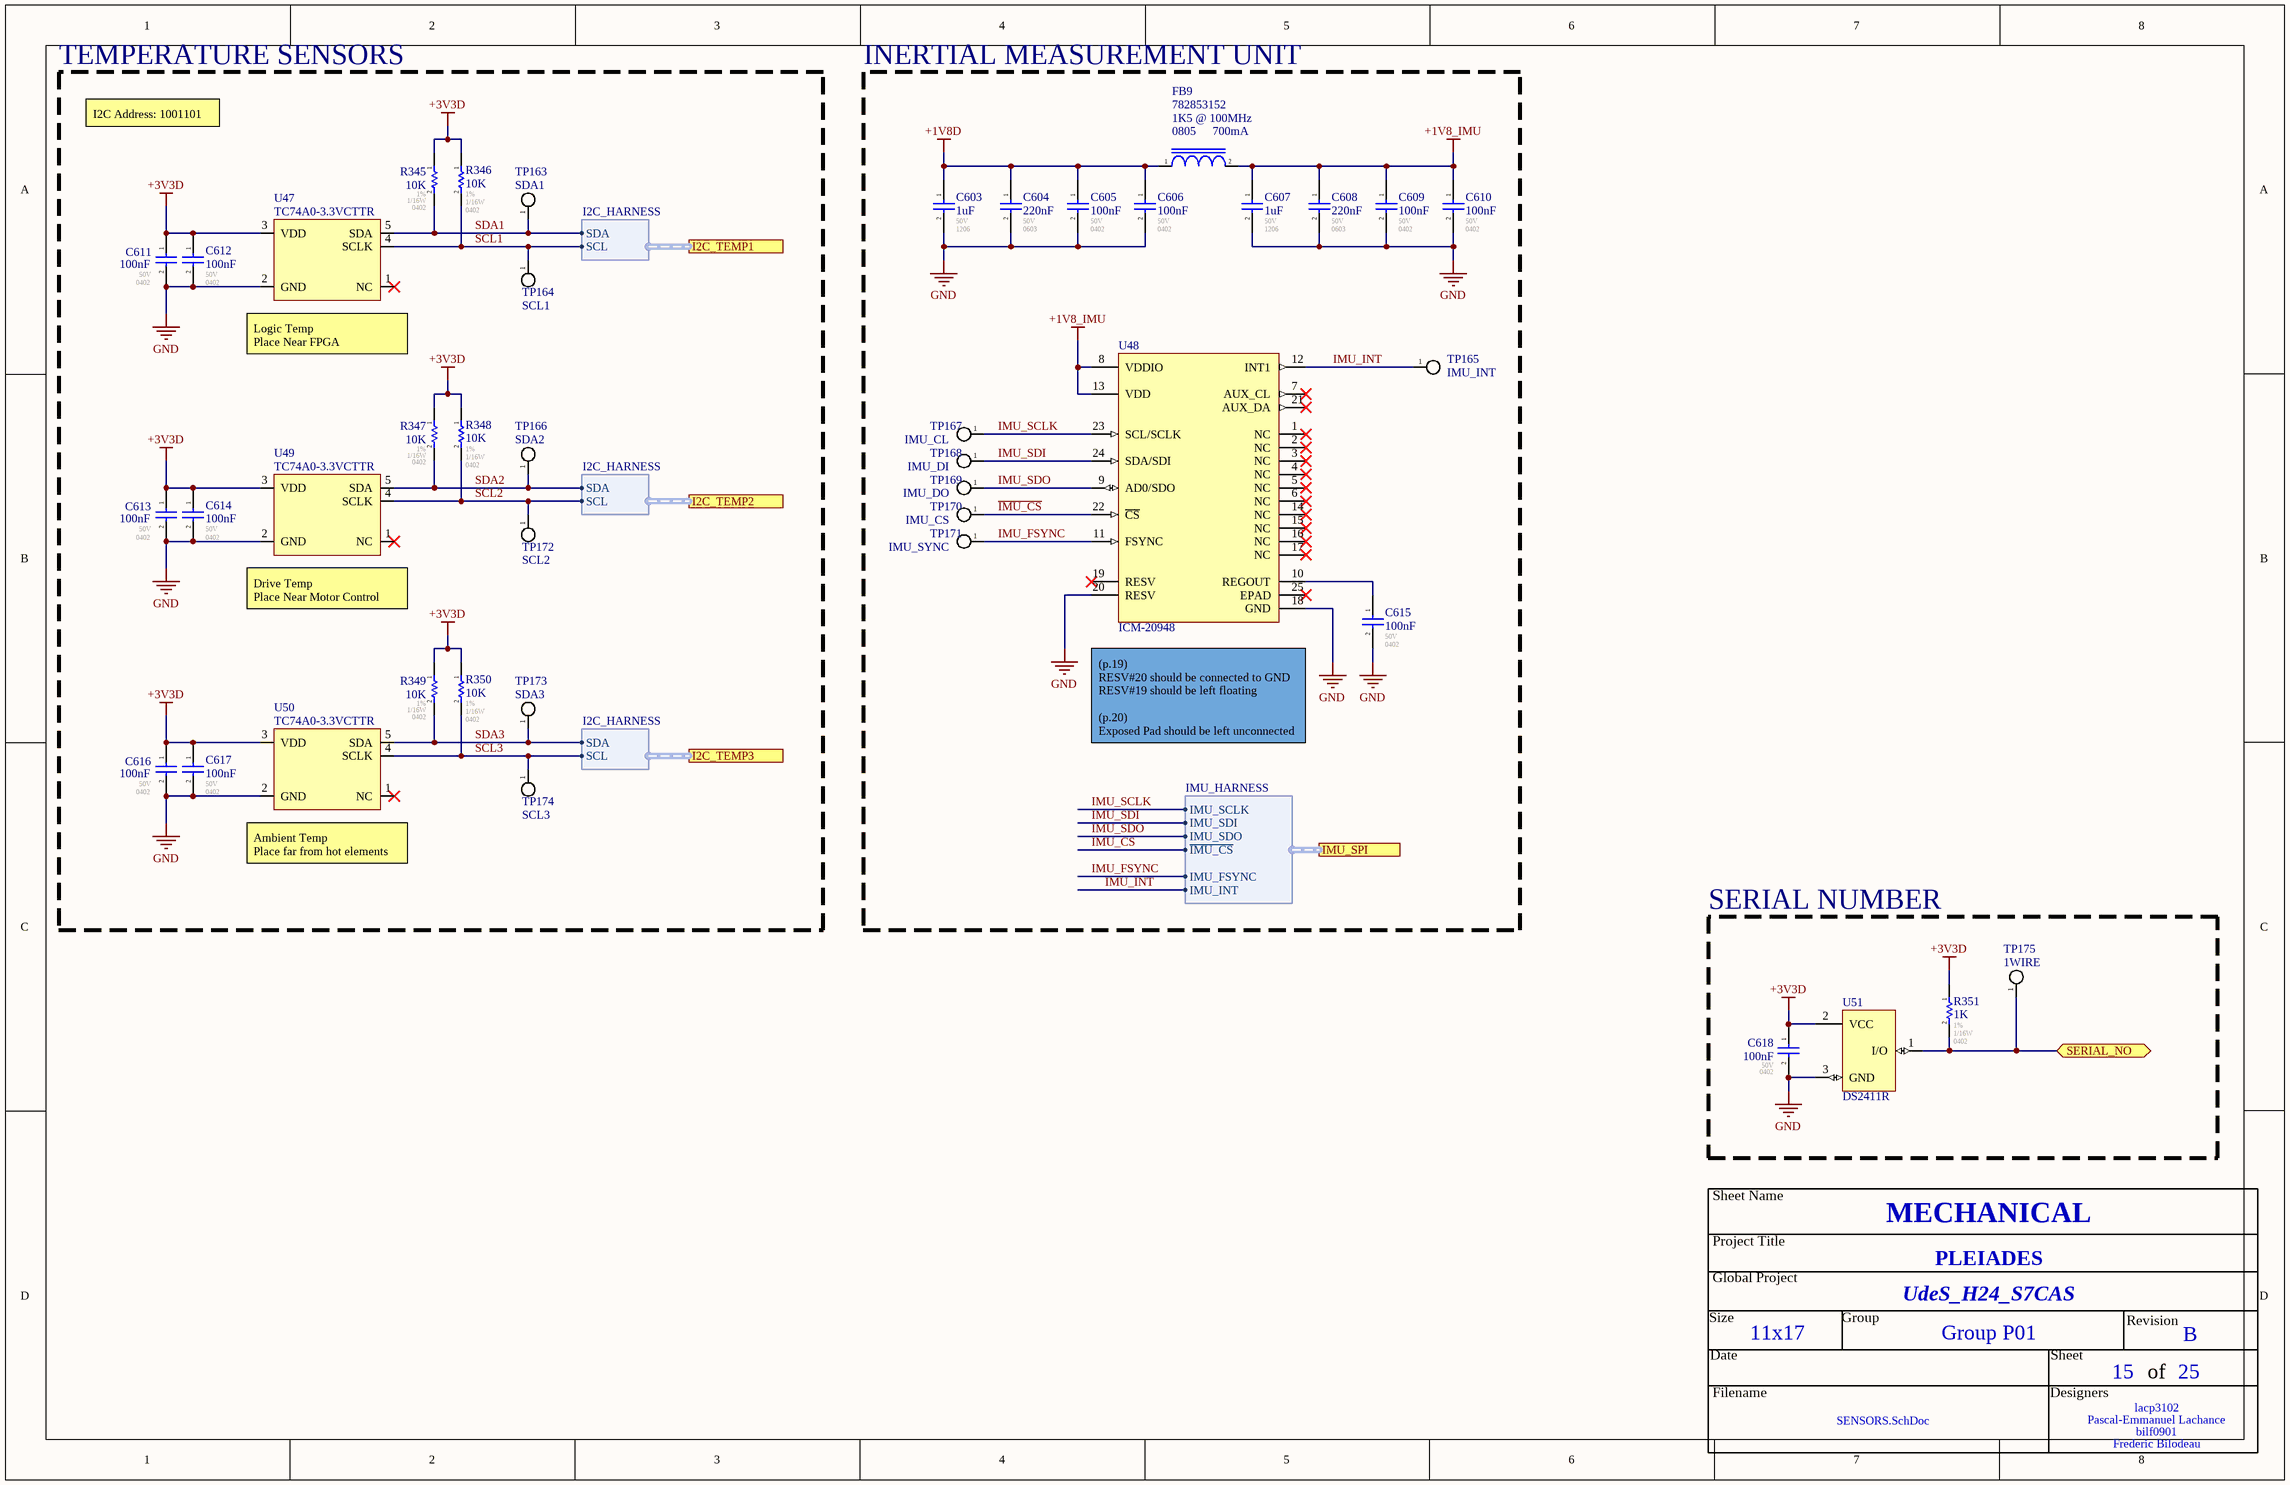
[diagram p63: SENSORS.SchDoc]

### Parts
C603  1uF  Voltage - Rated: 50V  Footprint: 1206  [CAP_1206]
C604  220nF  Voltage - Rated: 50V  Footprint: 0603  [CAP_0603]
C605  100nF  Voltage - Rated: 50V  Footprint: 0402  [CAP_0402]
C606  100nF  Voltage - Rated: 50V  Footprint: 0402  [CAP_0402]
C607  1uF  Voltage - Rated: 50V  Footprint: 1206  [CAP_1206]
C608  220nF  Voltage - Rated: 50V  Footprint: 0603  [CAP_0603]
C609  100nF  Voltage - Rated: 50V  Footprint: 0402  [CAP_0402]
C610  100nF  Voltage - Rated: 50V  Footprint: 0402  [CAP_0402]
C611  100nF  Voltage - Rated: 50V  Footprint: 0402  [CAP_0402]
C612  100nF  Voltage - Rated: 50V  Footprint: 0402  [CAP_0402]
C613  100nF  Voltage - Rated: 50V  Footprint: 0402  [CAP_0402]
C614  100nF  Voltage - Rated: 50V  Footprint: 0402  [CAP_0402]
C615  100nF  Voltage - Rated: 50V  Footprint: 0402  [CAP_0402]
C616  100nF  Voltage - Rated: 50V  Footprint: 0402  [CAP_0402]
C617  100nF  Voltage - Rated: 50V  Footprint: 0402  [CAP_0402]
C618  100nF  Voltage - Rated: 50V  Footprint: 0402  [CAP_0402]
FB9  782853152  Impedance @ Freq: 1K5 @ 100MHz  Package / Case: 0805  Current Rating: 700mA  [IND_0805]
R345  10K  Tolerance: 1%  Power: 1/16W  Package / Case: 0402  [RES_0402]
R346  10K  Tolerance: 1%  Power: 1/16W  Package / Case: 0402  [RES_0402]
R347  10K  Tolerance: 1%  Power: 1/16W  Package / Case: 0402  [RES_0402]
R348  10K  Tolerance: 1%  Power: 1/16W  Package / Case: 0402  [RES_0402]
R349  10K  Tolerance: 1%  Power: 1/16W  Package / Case: 0402  [RES_0402]
R350  10K  Tolerance: 1%  Power: 1/16W  Package / Case: 0402  [RES_0402]
R351  1K  Tolerance: 1%  Power: 1/16W  Package / Case: 0402  [RES_0402]
TP163  SDA1  [TP_PAD_SMALL]  (no BOM)
TP164  SCL1  [TP_PAD_SMALL]  (no BOM)
TP165  IMU_INT  [TP_PAD_SMALL]  (no BOM)
TP166  SDA2  [TP_PAD_SMALL]  (no BOM)
TP167  IMU_CL  [TP_PAD_SMALL]  (no BOM)
TP168  IMU_DI  [TP_PAD_SMALL]  (no BOM)
TP169  IMU_DO  [TP_PAD_SMALL]  (no BOM)
TP170  IMU_CS  [TP_PAD_SMALL]  (no BOM)
TP171  IMU_SYNC  [TP_PAD_SMALL]  (no BOM)
TP172  SCL2  [TP_PAD_SMALL]  (no BOM)
TP173  SDA3  [TP_PAD_SMALL]  (no BOM)
TP174  SCL3  [TP_PAD_SMALL]  (no BOM)
TP175  1WIRE  [TP_PAD_SMALL]  (no BOM)
U47  TC74A0-3.3VCTTR  [SEN_TEMP_TC74A0-3.3VCTTR]
U48  ICM-20948  [QFN-24_3X3]
U49  TC74A0-3.3VCTTR  [SEN_TEMP_TC74A0-3.3VCTTR]
U50  TC74A0-3.3VCTTR  [SEN_TEMP_TC74A0-3.3VCTTR]
U51  DS2411R  [SOT23-3]

### Blocks framed on the sheet
TEMPERATURE SENSORS: C611-C614 C616 C617 R345-R350 TP163 TP164 TP166 TP172-TP174 U47 U49 U50
INERTIAL MEASUREMENT UNIT: C603-C610 C615 FB9 TP165 TP167-TP171 U48
SERIAL NUMBER: C618 R351 TP175 U51

### Ports
I2C_TEMP1 (harness I2C_HARNESS), I2C_TEMP2 (harness I2C_HARNESS), I2C_TEMP3 (harness I2C_HARNESS), IMU_SPI (harness IMU_HARNESS), SERIAL_NO (bidir)

### Harnesses
I2C_HARNESS: SDA, SCL
IMU_HARNESS: IMU_SCLK, IMU_SDI, IMU_SDO, ~{IMU_CS}, IMU_FSYNC, IMU_INT

### Nets
+1V8_IMU: C607.1 C608.1 C609.1 C610.1 FB9.2 U48.8(VDDIO) U48.13(VDD)
+1V8D: C603.1 C604.1 C605.1 C606.1 FB9.1
+3V3D: C611.1 C612.1 C613.1 C614.1 C616.1 C617.1 C618.1 R345.1 R346.1 R347.1 R348.1 R349.1 R350.1 R351.1 U47.3(VDD) U49.3(VDD) U50.3(VDD) U51.2(VCC)
GND: C603.2 C604.2 C605.2 C606.2 C607.2 C608.2 C609.2 C610.2 C611.2 C612.2 C613.2 C614.2 C615.2 C616.2 C617.2 C618.2 U47.2(GND) U48.18(GND) U48.20(RESV) U49.2(GND) U50.2(GND) U51.3(GND)
~{IMU_CS}: TP170.1(A) U48.22(~{CS}) ; port IMU_SPI.~{IMU_CS}
IMU_FSYNC: TP171.1(A) U48.11(FSYNC) ; port IMU_SPI.IMU_FSYNC
IMU_INT: TP165.1(A) U48.12(INT1) ; port IMU_SPI.IMU_INT
IMU_SCLK: TP167.1(A) U48.23(SCL/SCLK) ; port IMU_SPI.IMU_SCLK
IMU_SDI: TP168.1(A) U48.24(SDA/SDI) ; port IMU_SPI.IMU_SDI
IMU_SDO: TP169.1(A) U48.9(AD0/SDO) ; port IMU_SPI.IMU_SDO
SCL1: R346.2 TP164.1(A) U47.4(SCLK) ; port I2C_TEMP1.SCL
SCL2: R348.2 TP172.1(A) U49.4(SCLK) ; port I2C_TEMP2.SCL
SCL3: R350.2 TP174.1(A) U50.4(SCLK) ; port I2C_TEMP3.SCL
SDA1: R345.2 TP163.1(A) U47.5(SDA) ; port I2C_TEMP1.SDA
SDA2: R347.2 TP166.1(A) U49.5(SDA) ; port I2C_TEMP2.SDA
SDA3: R349.2 TP173.1(A) U50.5(SDA) ; port I2C_TEMP3.SDA
SERIAL_NO: R351.2 TP175.1(A) U51.1(I/O) ; port SERIAL_NO
NetC615_1: C615.1 U48.10(REGOUT)

Not connected (* = marked no-connect by the designer): U47 1(NC)*; U48 1(NC)* 2(NC)* 3(NC)* 4(NC)* 5(NC)* 6(NC)* 7(AUX_CL)* 14(NC)* 15(NC)* 16(NC)* 17(NC)* 19(RESV)* 21(AUX_DA)* 25(EPAD)*; U49 1(NC)*; U50 1(NC)*

### Notes on the sheet
- I2C Address: 1001101
- (near U47) Logic Temp
  Place Near FPGA
- (near U49) Drive Temp
  Place Near Motor Control
- (near U48) (p.19)
  RESV#20 should be connected to GND
  RESV#19 should be left floating
  (p.20)
  Exposed Pad should be left unconnected
- (near U50) Ambient Temp
  Place far from hot elements
- Sheet Name
- Project Title
- Global Project
- Revision
- Size
- Date
- Group
- Sheet
- of
- Filename
- Designers

### Library data of the parts
C603 C607 = CAP_CER: as C549 on sheet PCI; Operating Temperature: -55C - 125C; Temperature Coefficient: X7R; ComponentLink1Description: Digikey; ComponentLink1URL: [Digikey Link]; Part#: GCJ31CR71H105KA12L; ComponentLink2Description: Datasheet; ComponentLink2URL: [Datasheet Link]; Tolerance: 10%; Ratings: AEC-Q200
C604 C608 = CAP_CER: GCM188R71H224KA64D / 0603 220nF 10% X7R Ceramic Capacitor; Mfr: Murata; Operating Temperature: -55C - 125C; Temperature Coefficient: X7R; ComponentLink1Description: Digikey; ComponentLink1URL: [Digikey Link]; Part#: GCM188R71H224KA64D; ComponentLink2Description: Datasheet; ComponentLink2URL: [Datasheet Link]; Tolerance: 10%; Ratings: AEC-Q200
C605 C606 C609-C618 = CAP_CER: as C537-C542 on sheet PCI; Operating Temperature: -55C - 125C; Temperature Coefficient: X7R; ComponentLink1Description: Digikey; ComponentLink1URL: [Digikey Link]; Part#: GCM155R71H104KE02J; ComponentLink2Description: Datasheet; ComponentLink2URL: [Datasheet Link]; Tolerance: 10%; Ratings: AEC-Q200
FB9 = FERRITE_BEAD: 600 Ohms @ 100 MHz 1 Signal Line Ferrite Bead 0603 (1608 Metric) 1A 200mOhm; Manufacturer: Wurth Elektronik; Resistance: 350mR; Operating Temperature: -55C - 125C; Rating: AEC-Q200; ComponentLink1Description: Digikey; ComponentLink1URL: https://www.digikey.ca/en/products/detail/w%C3%BCrth-elektronik/782853152/5168812; ComponentLink3Description: Octopart; ComponentLink3URL: https://octopart.com/782853152-wurth+elektronik-56466774?r=sp; ComponentLink5Description: Datasheet; ComponentLink5URL: https://www.we-online.com/en/components/products/datasheet/782853152.pdf
R345-R351 = RESISTOR: Automotive: AEC-Q200; Operating Temperature: *; # Digikey: *; ComponentLink1Description: Digikey; ComponentLink1URL: *; # Manufacturer: *
TP163-TP175 = TESTPOINT_PAD_SMALL: Test Point
U47 U49 U50 = SENS_TEMP_TC74A0-3.3VCTTR: SENS - TEMPERATURE SENSOR I2C/SMBUS - SOT23-5; Voltage: 2.7 V ~ 5.5 V; Mfg: Microchip; Precision: ±2°C (±3°C); Current: *; Power: *; Mfg Part Number: TC74A0-3.3VCTTR; HelpURL: http://ww1.microchip.com/downloads/en/DeviceDoc/21462D.pdf; CreatedBy: Jonathan Bouchard; Temperature: -40°C ~ 125°C; Value: *; Package: SOT23-5; Supplier 1: Digikey; Supplier Part Number 1: TC74A0-3.3VCTDKR-ND
U48 = ICM-20948: Accelerometer, Gyroscope, Magnetometer, 9 Axis Sensor I2C, SPI Output; Mfr: TDK InvenSense; Supply Voltage - Core: 1.8V - 3.3V; Supply Voltage - IO: 1.8V; Operating Temperature: -40C - 85C; Output Type: I2C, SPI; ComponentLink1Description: Digikey; ComponentLink1URL: https://www.digikey.ca/en/products/detail/tdk-invensense/icm-20948/6623535; ComponentLink2Description: Datasheet; ComponentLink2URL: https://invensense.tdk.com/wp-content/uploads/2016/06/DS-000189-ICM-20948-v1.3.pdf?ref_disty=digikey; ComponentLink3Description: Mfr; ComponentLink3URL: https://invensense.tdk.com/products/motion-tracking/9-axis/icm-20948/; ComponentLink4Description: Octopart; ComponentLink4URL: https://octopart.com/icm-20948-invensense-73011870?r=sp; Supplier 1: Mouser; Supplier Part Number 1: 410-ICM-20948
U51 = DS2411R: Silicon Serial Number SOT-23-3; Mfr: Analog Devices; Standyby Current: < 1µA; Serial Number: 48-bits

## Sheet JTAG.SchDoc
size Tabloid; SheetNumber: 7; SheetTotal: 25; Sheet_Name: JTAG; Size: 11x17
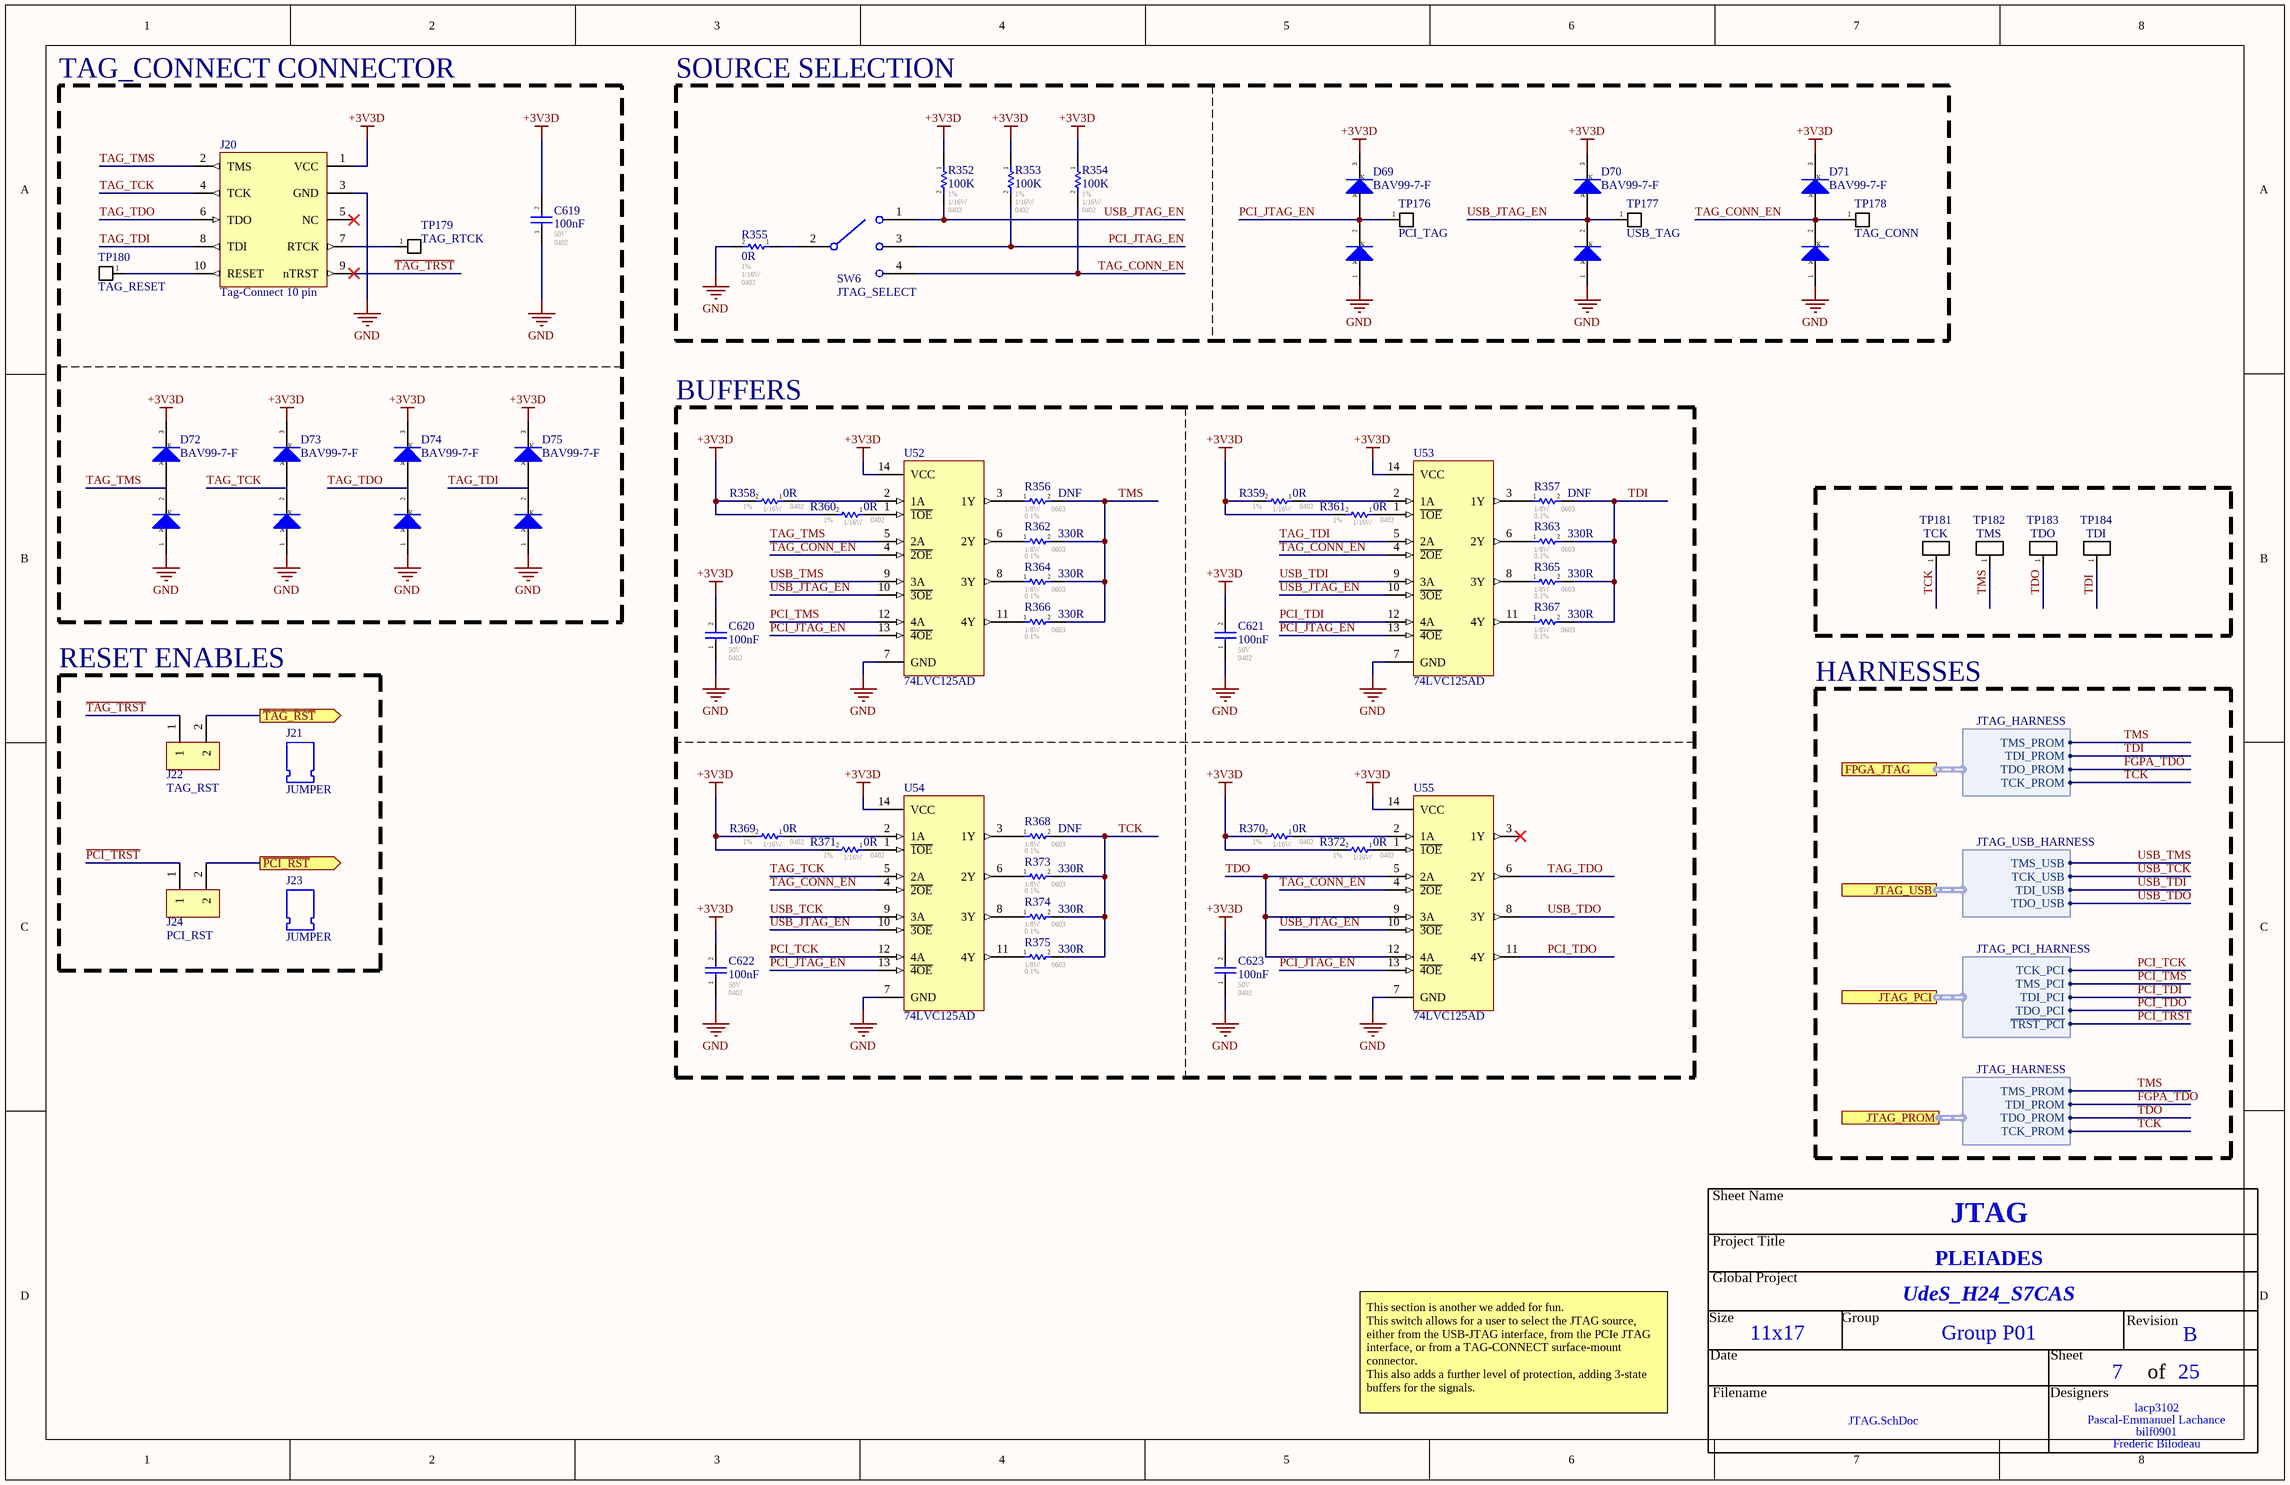
[diagram p64: JTAG.SchDoc]

### Parts
C619  100nF  Voltage - Rated: 50V  Footprint: 0402  [CAP_0402]
C620  100nF  Voltage - Rated: 50V  Footprint: 0402  [CAP_0402]
C621  100nF  Voltage - Rated: 50V  Footprint: 0402  [CAP_0402]
C622  100nF  Voltage - Rated: 50V  Footprint: 0402  [CAP_0402]
C623  100nF  Voltage - Rated: 50V  Footprint: 0402  [CAP_0402]
D69  BAV99-7-F  [SOT23-3]
D70  BAV99-7-F  [SOT23-3]
D71  BAV99-7-F  [SOT23-3]
D72  BAV99-7-F  [SOT23-3]
D73  BAV99-7-F  [SOT23-3]
D74  BAV99-7-F  [SOT23-3]
D75  BAV99-7-F  [SOT23-3]
J20  Tag-Connect 10 pin  [TC2050-NL]
J21  JUMPER  (mechanical)
J22  TAG_RST  [HEADER-2_100MIL]
J23  JUMPER  (mechanical)
J24  PCI_RST  [HEADER-2_100MIL]
R352  100K  Tolerance: 1%  Power: 1/16W  Package / Case: 0402  [RES_0402]
R353  100K  Tolerance: 1%  Power: 1/16W  Package / Case: 0402  [RES_0402]
R354  100K  Tolerance: 1%  Power: 1/16W  Package / Case: 0402  [RES_0402]
R355  0R  Tolerance: 1%  Power: 1/16W  Package / Case: 0402  [RES_0402]
R356  DNF  Tolerance: 0.1%  Power: 1/8W  Package / Case: 0603  [RES_0603]
R357  DNF  Tolerance: 0.1%  Power: 1/8W  Package / Case: 0603  [RES_0603]
R358  0R  Tolerance: 1%  Power: 1/16W  Package / Case: 0402  [RES_0402]
R359  0R  Tolerance: 1%  Power: 1/16W  Package / Case: 0402  [RES_0402]
R360  0R  Tolerance: 1%  Power: 1/16W  Package / Case: 0402  [RES_0402]
R361  0R  Tolerance: 1%  Power: 1/16W  Package / Case: 0402  [RES_0402]
R362  330R  Tolerance: 0.1%  Power: 1/8W  Package / Case: 0603  [RES_0603]
R363  330R  Tolerance: 0.1%  Power: 1/8W  Package / Case: 0603  [RES_0603]
R364  330R  Tolerance: 0.1%  Power: 1/8W  Package / Case: 0603  [RES_0603]
R365  330R  Tolerance: 0.1%  Power: 1/8W  Package / Case: 0603  [RES_0603]
R366  330R  Tolerance: 0.1%  Power: 1/8W  Package / Case: 0603  [RES_0603]
R367  330R  Tolerance: 0.1%  Power: 1/8W  Package / Case: 0603  [RES_0603]
R368  DNF  Tolerance: 0.1%  Power: 1/8W  Package / Case: 0603  [RES_0603]
R369  0R  Tolerance: 1%  Power: 1/16W  Package / Case: 0402  [RES_0402]
R370  0R  Tolerance: 1%  Power: 1/16W  Package / Case: 0402  [RES_0402]
R371  0R  Tolerance: 1%  Power: 1/16W  Package / Case: 0402  [RES_0402]
R372  0R  Tolerance: 1%  Power: 1/16W  Package / Case: 0402  [RES_0402]
R373  330R  Tolerance: 0.1%  Power: 1/8W  Package / Case: 0603  [RES_0603]
R374  330R  Tolerance: 0.1%  Power: 1/8W  Package / Case: 0603  [RES_0603]
R375  330R  Tolerance: 0.1%  Power: 1/8W  Package / Case: 0603  [RES_0603]
SW6  JTAG_SELECT  [1825256-6]
TP176  PCI_TAG  [TP_PAD]  (no BOM)
TP177  USB_TAG  [TP_PAD]  (no BOM)
TP178  TAG_CONN  [TP_PAD]  (no BOM)
TP179  TAG_RTCK  [TP_PAD]  (no BOM)
TP180  TAG_RESET  [TP_PAD]  (no BOM)
TP181  TCK  [TP_HOLE]  (no BOM)
TP182  TMS  [TP_HOLE]  (no BOM)
TP183  TDO  [TP_HOLE]  (no BOM)
TP184  TDI  [TP_HOLE]  (no BOM)
U52  74LVC125AD  [SOIC-14_3.8MM]
U53  74LVC125AD  [SOIC-14_3.8MM]
U54  74LVC125AD  [SOIC-14_3.8MM]
U55  74LVC125AD  [SOIC-14_3.8MM]

### Blocks framed on the sheet
TAG_CONNECT CONNECTOR: C619 D72-D75 J20 TP179 TP180
SOURCE SELECTION: D69-D71 R352-R355 SW6 TP176-TP178
BUFFERS: C620-C623 R356-R375 U52-U55
RESET ENABLES: J21-J24

### Ports
FPGA_JTAG (harness JTAG_HARNESS), JTAG_PCI (harness JTAG_PCI_HARNESS), JTAG_PROM (harness JTAG_HARNESS), JTAG_USB (harness JTAG_USB_HARNESS), ~{PCI_RST} (out), ~{TAG_RST} (out)

### Harnesses
JTAG_USB_HARNESS: TCK_USB, TDO_USB, TDI_USB, TMS_USB
JTAG_HARNESS: TCK_PROM, TDO_PROM, TDI_PROM, TMS_PROM
JTAG_PCI_HARNESS: TCK_PCI, TDO_PCI, TDI_PCI, TMS_PCI, ~{TRST_PCI}

### Nets
+3V3D: C619.2 C620.2 C621.2 C622.2 C623.2 D69.3(K) D70.3(K) D71.3(K) D72.3(K) D73.3(K) D74.3(K) D75.3(K) J20.1(VCC) R352.1 R353.1 R354.1 R358.2 R359.2 R360.2 R361.2 R369.2 R370.2 R371.2 R372.2 U52.14(VCC) U53.14(VCC) U54.14(VCC) U55.14(VCC)
GND: C619.1 C620.1 C621.1 C622.1 C623.1 D69.1(A) D70.1(A) D71.1(A) D72.1(A) D73.1(A) D74.1(A) D75.1(A) J20.3(GND) R355.2 U52.7(GND) U53.7(GND) U54.7(GND) U55.7(GND)
~{PCI_RST}: J24.2 ; port ~{PCI_RST}
~{PCI_TRST}: J24.1 ; port JTAG_PCI.~{TRST_PCI}
~{TAG_RST}: J22.2 ; port ~{TAG_RST}
~{TAG_TRST}: J20.9(nTRST) J22.1  [project net ~{TAG_TRST_7}]
FGPA_TDO: port JTAG_PROM.TDI_PROM, port FPGA_JTAG.TDO_PROM
PCI_JTAG_EN: D69.2(K) R353.2 SW6.3 TP176.1(A) U52.13(~{4OE}) U53.13(~{4OE}) U54.13(~{4OE}) U55.13(~{4OE})  [project net PCI_JTAG_EN_7]
PCI_TCK: U54.12(4A) ; port JTAG_PCI.TCK_PCI
PCI_TDI: U53.12(4A) ; port JTAG_PCI.TDI_PCI
PCI_TDO: U55.11(4Y) ; port JTAG_PCI.TDO_PCI
PCI_TMS: U52.12(4A) ; port JTAG_PCI.TMS_PCI
TAG_CONN_EN: D71.2(K) R354.2 SW6.4 TP178.1(A) U52.4(~{2OE}) U53.4(~{2OE}) U54.4(~{2OE}) U55.4(~{2OE})  [project net TAG_CONN_EN_7]
TAG_TCK: D73.2(K) J20.4(TCK) U54.5(2A)  [project net TAG_TCK_7]
TAG_TDI: D75.2(K) J20.8(TDI) U53.5(2A)  [project net TAG_TDI_7]
TAG_TDO: D74.2(K) J20.6(TDO) U55.6(2Y)  [project net TAG_TDO_7]
TAG_TMS: D72.2(K) J20.2(TMS) U52.5(2A)  [project net TAG_TMS_7]
TCK: R368.2 R373.2 R374.2 R375.2 TP181.1(A) ; port JTAG_PROM.TCK_PROM, port FPGA_JTAG.TCK_PROM  [project net PROM_TCK]
TDI: R357.2 R363.2 R365.2 R367.2 TP184.1(A) ; port FPGA_JTAG.TDI_PROM
TDO: TP183.1(A) U55.5(2A) U55.9(3A) U55.12(4A) ; port JTAG_PROM.TDO_PROM  [project net PROM_TDO]
TMS: R356.2 R362.2 R364.2 R366.2 TP182.1(A) ; port JTAG_PROM.TMS_PROM, port FPGA_JTAG.TMS_PROM  [project net PROM_TMS]
USB_JTAG_EN: D70.2(K) R352.2 SW6.1 TP177.1(A) U52.10(~{3OE}) U53.10(~{3OE}) U54.10(~{3OE}) U55.10(~{3OE})  [project net USB_JTAG_EN_7]
USB_TCK: U54.9(3A) ; port JTAG_USB.TCK_USB  [project net TCK_USB]
USB_TDI: U53.9(3A) ; port JTAG_USB.TDI_USB  [project net TDI_USB]
USB_TDO: U55.8(3Y) ; port JTAG_USB.TDO_USB  [project net TDO_USB]
USB_TMS: U52.9(3A) ; port JTAG_USB.TMS_USB  [project net TMS_USB]
NetJ20_7: J20.7(RTCK) TP179.1(A)
NetJ20_10: J20.10(RESET) TP180.1(A)
NetR355_1: R355.1 SW6.2
NetR356_1: R356.1 U52.3(1Y)
NetR357_1: R357.1 U53.3(1Y)
NetR358_1: R358.1 U52.2(1A)
NetR359_1: R359.1 U53.2(1A)
NetR360_1: R360.1 U52.1(~{1OE})
NetR361_1: R361.1 U53.1(~{1OE})
NetR362_1: R362.1 U52.6(2Y)
NetR363_1: R363.1 U53.6(2Y)
NetR364_1: R364.1 U52.8(3Y)
NetR365_1: R365.1 U53.8(3Y)
NetR366_1: R366.1 U52.11(4Y)
NetR367_1: R367.1 U53.11(4Y)
NetR368_1: R368.1 U54.3(1Y)
NetR369_1: R369.1 U54.2(1A)
NetR370_1: R370.1 U55.2(1A)
NetR371_1: R371.1 U54.1(~{1OE})
NetR372_1: R372.1 U55.1(~{1OE})
NetR373_1: R373.1 U54.6(2Y)
NetR374_1: R374.1 U54.8(3Y)
NetR375_1: R375.1 U54.11(4Y)

Not connected (* = marked no-connect by the designer): J20 5(NC)*; U55 3(1Y)*

### Notes on the sheet
- HARNESSES
- This section is another we added for fun.
  This switch allows for a user to select the JTAG source, either from the USB-JTAG interface, from the PCIe JTAG interface, or from a TAG-CONNECT surface-mount connector.
  This also adds a further level of protection, adding 3-state buffers for the signals.
- Sheet Name
- Project Title
- Global Project
- Revision
- Size
- Date
- Group
- Sheet
- of
- Filename
- Designers

### Library data of the parts
C619-C623 = CAP_CER: as C537-C542 on sheet PCI; Operating Temperature: -55C - 125C; Temperature Coefficient: X7R; ComponentLink1Description: Digikey; ComponentLink1URL: [Digikey Link]; Part#: GCM155R71H104KE02J; ComponentLink2Description: Datasheet; ComponentLink2URL: [Datasheet Link]; Tolerance: 10%; Ratings: AEC-Q200
D69-D75 = DIODE_TVS_DUAL: as D60-D68 on sheet PCI; Operating Temperature: -65C - 150C; Package / Case: SOT-23-3; Current: 300mA; ComponentLink1Description: Digikey; ComponentLink1URL: https://www.digikey.ca/en/products/detail/diodes-incorporated/BAV99-7-F/815018; ComponentLink2Description: Datasheet; ComponentLink2URL: https://www.diodes.com/assets/Datasheets/BAV99.pdf; ComponentLink3Description: Octopart; ComponentLink3URL: https://octopart.com/bav99-7-f-diodes+inc.-326328; Supplier 1: Future Electronics; Supplier Part Number 1: 3851920
J20 = TC2050-NL
J22 J24 = HEADER_2
R352-R355 R358-R361 R369-R372 = RESISTOR: Automotive: AEC-Q200; Operating Temperature: *; # Digikey: *; ComponentLink1Description: Digikey; ComponentLink1URL: *; # Manufacturer: *
R356 R357 R362-R368 R373-R375 = RESISTOR: 1M 0603 1% 1/16W Resistor; Automotive: AEC-Q200; Operating Temperature: *; # Digikey: *; ComponentLink1Description: Digikey; ComponentLink1URL: *; # Manufacturer: *
SW6 = SP3T_SWITCH: 1825256-6 / Slide Switch SP3T Through Hole, Right Angle; Mfr: TE Connectivity; Switch Function: On-On-On; Current Rating: 400mA; Voltage Rating - AC: 20V; Cycles: 15000; Voltage Rating - DC: 20V; Operating Temperature: -20C - 85C
TP176-TP180 = TESTPOINT_PAD: Test Point
TP181-TP184 = TESTPOINT: Test Point; ClassName: Testpoint
U52-U55 = 74LVC125AD,118: Buffer, Non-Inverting 4 Element 1 Bit per Element 3-State Output 14-SO; Mfr: Nexperia; Number of Elements: 4; Voltage - Supply: 1.2V - 3.6V; Output Type: 3-state; Operating Temperature: -40C - 125C; ComponentLink1Description: Digikey; ComponentLink1URL: https://www.digikey.ca/en/products/detail/nexperia-usa-inc/74LVC125AD-118/946677; ComponentLink2Description: Datasheet; ComponentLink2URL: https://assets.nexperia.com/documents/data-sheet/74LVC125A.pdf; ComponentLink3Description: Mfr; ComponentLink3URL: https://www.nexperia.com/products/analog-logic-ics/logic/buffers-inverters-transceivers/buffers/74LVC125AD.html; ComponentLink4Description: Octopart; ComponentLink4URL: https://octopart.com/74lvc125ad%2C118-nexperia-78737785?r=sp